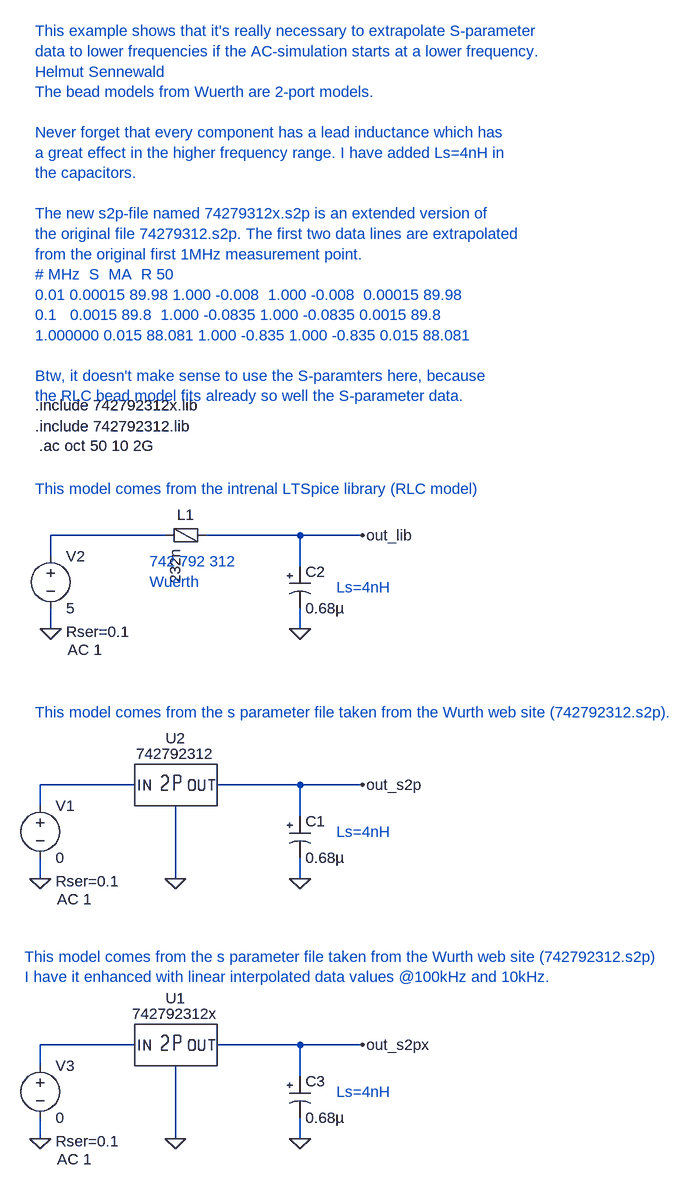
[diagram p0: schematic Ferrite_s2p_1.asc]
Ferrite_s2p_1.asc, the LTspice schematic file:
Version 4
SHEET 1 1888 1724
WIRE 240 432 240 400
WIRE 240 544 240 512
WIRE 240 832 240 800
WIRE 240 944 240 912
WIRE 256 48 256 16
WIRE 256 160 256 128
WIRE 384 400 240 400
WIRE 384 800 240 800
WIRE 432 16 256 16
WIRE 448 544 448 432
WIRE 448 944 448 832
WIRE 640 16 496 16
WIRE 640 64 640 16
WIRE 640 160 640 128
WIRE 640 400 512 400
WIRE 640 448 640 400
WIRE 640 544 640 512
WIRE 640 800 512 800
WIRE 640 848 640 800
WIRE 640 944 640 912
WIRE 736 16 640 16
WIRE 736 400 640 400
WIRE 736 800 640 800
FLAG 640 544 0
FLAG 240 544 0
FLAG 736 400 out_s2p
FLAG 640 160 0
FLAG 256 160 0
FLAG 736 16 out_lib
FLAG 448 544 0
FLAG 640 944 0
FLAG 240 944 0
FLAG 736 800 out_s2px
FLAG 448 944 0
SYMBOL polcap 624 448 R0
WINDOW 3 24 64 Left 0
SYMATTR Value 0.68µ
SYMATTR InstName C1
SYMATTR Description Capacitor
SYMATTR Type cap
SYMATTR SpiceLine V=50 Irms=28m Rser=3.7 MTBF=2000 Lser=5n ppPkg=1
SYMBOL voltage 240 416 R0
WINDOW 123 26 160 Left 0
WINDOW 39 24 132 Left 0
SYMATTR Value2 AC 1
SYMATTR SpiceLine Rser=0.1
SYMATTR InstName V1
SYMATTR Value 0
SYMBOL polcap 624 64 R0
WINDOW 3 24 64 Left 0
SYMATTR Value 0.68µ
SYMATTR InstName C2
SYMATTR Description Capacitor
SYMATTR Type cap
SYMATTR SpiceLine V=50 Irms=28m Rser=3.7 MTBF=2000 Lser=5n ppPkg=1
SYMBOL voltage 256 32 R0
WINDOW 123 26 160 Left 0
WINDOW 39 24 132 Left 0
SYMATTR Value2 AC 1
SYMATTR SpiceLine Rser=0.1
SYMATTR InstName V2
SYMATTR Value 5
SYMBOL FerriteBead 464 16 R90
WINDOW 0 -16 0 VBottom 0
SYMATTR InstName L1
SYMATTR Value 232n
SYMATTR SpiceLine Ipk=3 Rser=0.03 Rpar=77 Cpar=62f mfg="Wurth Elektronik eiSos" pn="742 792 312"
SYMBOL S2PORT 448 400 R0
SYMATTR Value 742792312
SYMATTR InstName U2
SYMBOL polcap 624 848 R0
WINDOW 3 24 64 Left 0
SYMATTR Value 0.68µ
SYMATTR InstName C3
SYMATTR Description Capacitor
SYMATTR Type cap
SYMATTR SpiceLine V=50 Irms=28m Rser=3.7 MTBF=2000 Lser=5n ppPkg=1
SYMBOL voltage 240 816 R0
WINDOW 123 26 160 Left 0
WINDOW 39 24 132 Left 0
SYMATTR Value2 AC 1
SYMATTR SpiceLine Rser=0.1
SYMATTR InstName V3
SYMATTR Value 0
SYMBOL S2PORT 448 800 R0
SYMATTR Value 742792312x
SYMATTR InstName U1
TEXT 232 -152 Left 0 !.include 742792312.lib
TEXT 238 -122 Left 0 !.ac oct 50 10 2G
TEXT 232 288 Left 0 ;This model comes from the s parameter file taken from the Wurth web site (742792312.s2p).
TEXT 232 -56 Left 0 ;This model comes from the intrenal LTSpice library (RLC model)
TEXT 232 -184 Left 0 !.include 742792312x.lib
TEXT 216 664 Left 0 ;This model comes from the s parameter file taken from the Wurth web site (742792312.s2p)\nI have it enhanced with linear interpolated data values @100kHz and 10kHz.
TEXT 408 56 Left 0 ;742 792 312\nWuerth
TEXT 696 96 Left 0 ;Ls=4nH
TEXT 696 472 Left 0 ;Ls=4nH
TEXT 696 872 Left 0 ;Ls=4nH
TEXT 232 -760 Left 0 ;This example shows that it's really necessary to extrapolate S-parameter \ndata to lower frequencies if the AC-simulation starts at a lower frequency.\nHelmut Sennewald\nThe bead models from Wuerth are 2-port models.\n \nNever forget that every component has a lead inductance which has \na great effect in the higher frequency range. I have added Ls=4nH in \nthe capacitors.\n \nThe new s2p-file named 74279312x.s2p is an extended version of \nthe original file 74279312.s2p. The first two data lines are extrapolated \nfrom the original first 1MHz measurement point.\n# MHz  S  MA  R 50\n0.01 0.00015 89.98 1.000 -0.008  1.000 -0.008  0.00015 89.98  \n0.1   0.0015 89.8  1.000 -0.0835 1.000 -0.0835 0.0015 89.8\n1.000000 0.015 88.081 1.000 -0.835 1.000 -0.835 0.015 88.081\n \nBtw, it doesn't make sense to use the S-paramters here, because\nthe RLC bead model fits already so well the S-parameter data.

The netlist it stands for:
* Ferrite_s2p_1.asc
C1 out_s2p 0 0.68µ V=50 Irms=28m Rser=3.7 MTBF=2000 Lser=5n ppPkg=1
V1 N001 0 0 AC 1 Rser=0.1
C2 out_lib 0 0.68µ V=50 Irms=28m Rser=3.7 MTBF=2000 Lser=5n ppPkg=1
V2 N003 0 5 AC 1 Rser=0.1
L1 out_lib N003 232n Ipk=3 Rser=0.03 Rpar=77 Cpar=62f mfg="Wurth Elektronik eiSos" pn="742 792 312"
XU2 N001 out_s2p 0 742792312  ; pins 1 2 3
C3 out_s2px 0 0.68µ V=50 Irms=28m Rser=3.7 MTBF=2000 Lser=5n ppPkg=1
V3 N002 0 0 AC 1 Rser=0.1
XU1 N002 out_s2px 0 742792312x  ; pins 1 2 3
.include 742792312.lib
.ac oct 50 10 2G
* This model comes from the s parameter file taken from the Wurth web site (742792312.s2p).
* This model comes from the intrenal LTSpice library (RLC model)
.include 742792312x.lib
* This model comes from the s parameter file taken from the Wurth web site (742792312.s2p)
* I have it enhanced with linear interpolated data values @100kHz and 10kHz.
* 742 792 312
* Wuerth
* Ls=4nH
* Ls=4nH
* Ls=4nH
* This example shows that it's really necessary to extrapolate S-parameter
* data to lower frequencies if the AC-simulation starts at a lower frequency.
* Helmut Sennewald
* The bead models from Wuerth are 2-port models.
* Never forget that every component has a lead inductance which has
* a great effect in the higher frequency range. I have added Ls=4nH in
* the capacitors.
* The new s2p-file named 74279312x.s2p is an extended version of
* the original file 74279312.s2p. The first two data lines are extrapolated
* from the original first 1MHz measurement point.
* # MHz  S  MA  R 50
* 0.01 0.00015 89.98 1.000 -0.008  1.000 -0.008  0.00015 89.98
* 0.1   0.0015 89.8  1.000 -0.0835 1.000 -0.0835 0.0015 89.8
* 1.000000 0.015 88.081 1.000 -0.835 1.000 -0.835 0.015 88.081
* Btw, it doesn't make sense to use the S-paramters here, because
* the RLC bead model fits already so well the S-parameter data.
.backanno
.end